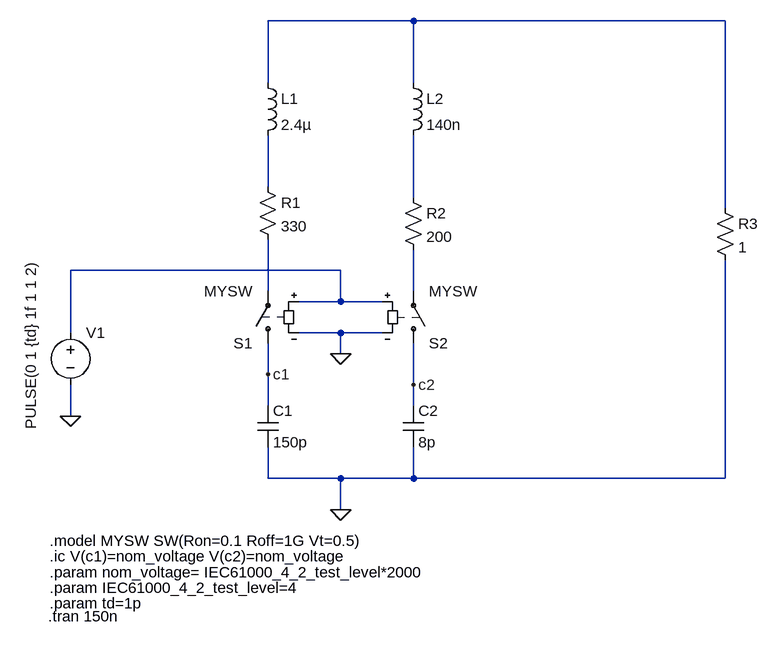
[diagram p0: schematic IEC61000_4_2.asc]
IEC61000_4_2.asc, the LTspice schematic file:
Version 4
SHEET 1 1156 680
WIRE 592 -320 368 -320
WIRE 1072 -320 592 -320
WIRE 368 -224 368 -320
WIRE 592 -224 592 -320
WIRE 368 -64 368 -144
WIRE 592 -48 592 -144
WIRE 1072 -32 1072 -320
WIRE 480 64 64 64
WIRE 368 96 368 16
WIRE 592 96 592 32
WIRE 480 112 480 64
WIRE 480 112 416 112
WIRE 544 112 480 112
WIRE 64 160 64 64
WIRE 480 160 416 160
WIRE 544 160 480 160
WIRE 480 192 480 160
WIRE 368 224 368 176
WIRE 592 240 592 176
WIRE 368 272 368 224
WIRE 592 272 592 240
WIRE 64 288 64 240
WIRE 368 384 368 336
WIRE 480 384 368 384
WIRE 592 384 592 336
WIRE 592 384 480 384
WIRE 1072 384 1072 48
WIRE 1072 384 592 384
WIRE 480 432 480 384
FLAG 480 432 0
FLAG 480 192 0
FLAG 64 288 0
FLAG 368 224 c1
FLAG 592 240 c2
SYMBOL voltage 64 144 R0
WINDOW 3 -61 -95 VRight 2
WINDOW 123 0 0 Left 0
WINDOW 39 0 0 Left 0
SYMATTR InstName V1
SYMATTR Value PULSE(0 1 {td} 1f 1 1 2)
SYMBOL sw 368 192 R180
SYMATTR InstName S1
SYMATTR Value MYSW
SYMATTR Prefix SW
SYMBOL sw 592 192 M180
SYMATTR InstName S2
SYMATTR Value MYSW
SYMATTR Prefix SW
SYMBOL cap 352 272 R0
SYMATTR InstName C1
SYMATTR Value 150p
SYMBOL cap 576 272 R0
SYMATTR InstName C2
SYMATTR Value 8p
SYMBOL res 352 -80 R0
SYMATTR InstName R1
SYMATTR Value 330
SYMBOL res 576 -64 R0
SYMATTR InstName R2
SYMATTR Value 200
SYMBOL ind 352 -240 R0
SYMATTR InstName L1
SYMATTR Value 2.4µ
SYMBOL ind 576 -240 R0
SYMATTR InstName L2
SYMATTR Value 140n
SYMBOL res 1056 -48 R0
SYMATTR InstName R3
SYMATTR Value 1
TEXT 32 480 Left 2 !.model MYSW SW(Ron=0.1 Roff=1G Vt=0.5)
TEXT 32 504 Left 2 !.ic V(c1)=nom_voltage V(c2)=nom_voltage
TEXT 32 528 Left 2 !.param nom_voltage= IEC61000_4_2_test_level*2000
TEXT 32 552 Left 2 !.param IEC61000_4_2_test_level=4
TEXT 32 576 Left 2 !.param td=1p
TEXT 30 596 Left 2 !.tran 150n

The netlist it stands for:
* IEC61000_4_2.asc
V1 N004 0 PULSE(0 1 {td} 1f 1 1 2)
S1 c1 N005 N004 0 MYSW
S2 c2 N006 N004 0 MYSW
C1 c1 0 150p
C2 c2 0 8p
R1 N002 N005 330
R2 N003 N006 200
L1 N001 N002 2.4µ
L2 N001 N003 140n
R3 N001 0 1
.model MYSW SW(Ron=0.1 Roff=1G Vt=0.5)
.ic V(c1)=nom_voltage V(c2)=nom_voltage
.param nom_voltage= IEC61000_4_2_test_level*2000
.param IEC61000_4_2_test_level=4
.param td=1p
.tran 150n
.backanno
.end